# Altium schematic sheet US100.SchDoc
size A4
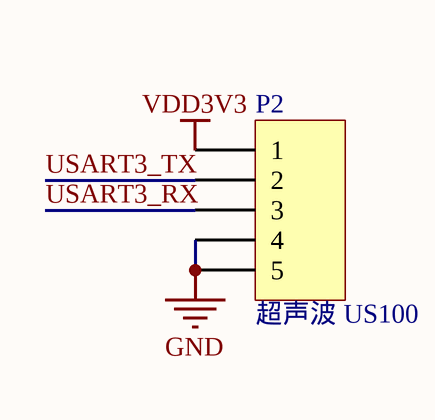
[diagram p0: US100.SchDoc]

## Parts
P2  超声波 US100  [HDR1X5]

## Nets
GND: P2.4 P2.5
VDD3V3: P2.1
USART3_RX: P2.3
USART3_TX: P2.2

## Library data of the parts
P2 = Header 5: Header, 5-Pin; LatestRevisionDate: 17-Jul-2002; LatestRevisionNote: Re-released for DXP Platform.; Publisher: Altium Limited